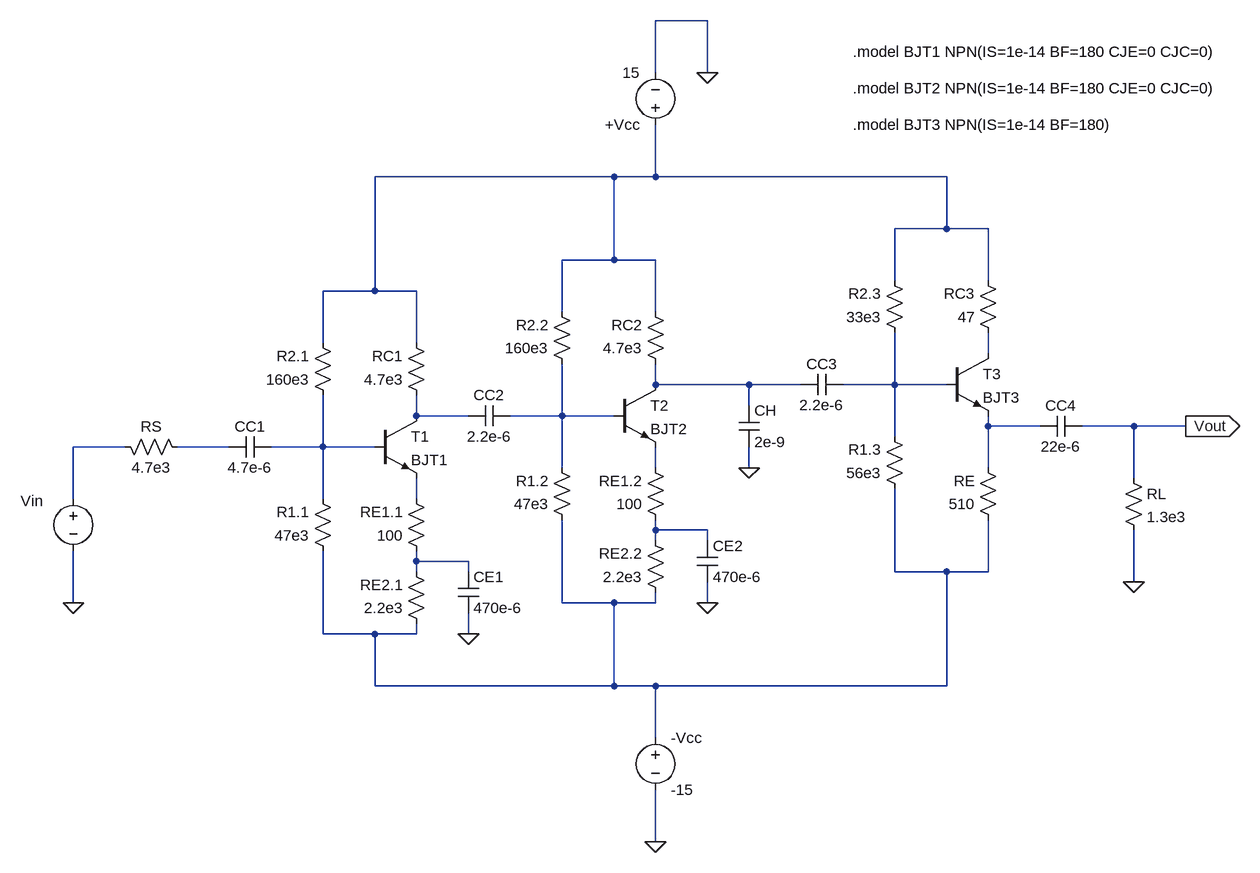
[diagram p0: schematic faz2B.asc]
faz2B.asc, the LTspice schematic file:
Version 4
SHEET 1 1896 1972
WIRE -336 -496 -416 -496
WIRE -416 -416 -416 -496
WIRE -336 -416 -336 -496
WIRE -480 -256 -848 -256
WIRE -416 -256 -416 -336
WIRE -416 -256 -480 -256
WIRE 32 -256 -416 -256
WIRE 32 -176 32 -256
WIRE 32 -176 -48 -176
WIRE 96 -176 32 -176
WIRE -480 -128 -480 -256
WIRE -480 -128 -560 -128
WIRE -416 -128 -480 -128
WIRE -48 -96 -48 -176
WIRE 96 -96 96 -176
WIRE -848 -80 -848 -256
WIRE -848 -80 -928 -80
WIRE -784 -80 -848 -80
WIRE -560 -48 -560 -128
WIRE -416 -48 -416 -128
WIRE -928 0 -928 -80
WIRE -784 0 -784 -80
WIRE 96 16 96 -16
WIRE -416 64 -416 32
WIRE -272 64 -416 64
WIRE -192 64 -272 64
WIRE -48 64 -48 -16
WIRE -48 64 -128 64
WIRE 32 64 -48 64
WIRE -272 96 -272 64
WIRE -784 112 -784 80
WIRE -704 112 -784 112
WIRE -560 112 -560 32
WIRE -560 112 -640 112
WIRE -480 112 -560 112
WIRE 96 128 96 112
WIRE 176 128 96 128
WIRE 320 128 240 128
WIRE 400 128 320 128
WIRE -48 144 -48 64
WIRE -1232 160 -1312 160
WIRE -1072 160 -1152 160
WIRE -928 160 -928 80
WIRE -928 160 -1008 160
WIRE -848 160 -928 160
WIRE -560 192 -560 112
WIRE -416 192 -416 160
WIRE -272 192 -272 160
WIRE 96 192 96 128
WIRE 320 208 320 128
WIRE -1312 240 -1312 160
WIRE -928 240 -928 160
WIRE -784 240 -784 208
WIRE -416 288 -416 272
WIRE -336 288 -416 288
WIRE -416 304 -416 288
WIRE -336 304 -336 288
WIRE -784 336 -784 320
WIRE -704 336 -784 336
WIRE -784 352 -784 336
WIRE -704 352 -704 336
WIRE -48 352 -48 224
WIRE 32 352 -48 352
WIRE 96 352 96 272
WIRE 96 352 32 352
WIRE 320 368 320 288
WIRE -1312 400 -1312 320
WIRE -560 400 -560 272
WIRE -480 400 -560 400
WIRE -416 400 -416 384
WIRE -416 400 -480 400
WIRE -336 400 -336 368
WIRE -928 448 -928 320
WIRE -848 448 -928 448
WIRE -784 448 -784 432
WIRE -784 448 -848 448
WIRE -704 448 -704 416
WIRE -848 528 -848 448
WIRE -480 528 -480 400
WIRE -480 528 -848 528
WIRE -416 528 -480 528
WIRE 32 528 32 352
WIRE 32 528 -416 528
WIRE -416 608 -416 528
WIRE -416 768 -416 688
FLAG 320 368 0
FLAG 400 128 Vout
IOPIN 400 128 Out
FLAG -704 448 0
FLAG -1312 400 0
FLAG -336 400 0
FLAG -416 768 0
FLAG -336 -416 0
FLAG -272 192 0
SYMBOL cap -128 48 R90
WINDOW 0 0 32 VBottom 2
WINDOW 3 32 32 VTop 2
SYMATTR InstName CC3
SYMATTR Value 2.2e-6
SYMBOL res -32 0 R180
WINDOW 0 36 76 Left 2
WINDOW 3 36 40 Left 2
SYMATTR InstName R2.3
SYMATTR Value 33e3
SYMBOL res -32 240 R180
WINDOW 0 36 76 Left 2
WINDOW 3 36 40 Left 2
SYMATTR InstName R1.3
SYMATTR Value 56e3
SYMBOL npn 32 16 R0
SYMATTR InstName T3
SYMATTR Value BJT3
SYMBOL res 112 0 R180
WINDOW 0 36 76 Left 2
WINDOW 3 36 40 Left 2
SYMATTR InstName RC3
SYMATTR Value 47
SYMBOL res 112 288 R180
WINDOW 0 36 76 Left 2
WINDOW 3 36 40 Left 2
SYMATTR InstName RE
SYMATTR Value 510
SYMBOL res -1248 144 M90
WINDOW 0 0 56 VBottom 2
WINDOW 3 32 56 VTop 2
SYMATTR InstName RS
SYMATTR Value 4.7e3
SYMBOL cap 240 112 R90
WINDOW 0 0 32 VBottom 2
WINDOW 3 32 32 VTop 2
SYMATTR InstName CC4
SYMATTR Value 22e-6
SYMBOL res 304 192 R0
SYMATTR InstName RL
SYMATTR Value 1.3e3
SYMBOL npn -848 112 R0
SYMATTR InstName T1
SYMATTR Value BJT1
SYMBOL res -912 96 R180
WINDOW 0 36 76 Left 2
WINDOW 3 36 40 Left 2
SYMATTR InstName R2.1
SYMATTR Value 160e3
SYMBOL res -768 96 R180
WINDOW 0 36 76 Left 2
WINDOW 3 36 40 Left 2
SYMATTR InstName RC1
SYMATTR Value 4.7e3
SYMBOL res -912 336 R180
WINDOW 0 36 76 Left 2
WINDOW 3 36 40 Left 2
SYMATTR InstName R1.1
SYMATTR Value 47e3
SYMBOL res -768 336 R180
WINDOW 0 36 76 Left 2
WINDOW 3 36 40 Left 2
SYMATTR InstName RE1.1
SYMATTR Value 100
SYMBOL res -768 448 R180
WINDOW 0 36 76 Left 2
WINDOW 3 36 40 Left 2
SYMATTR InstName RE2.1
SYMATTR Value 2.2e3
SYMBOL cap -720 352 R0
SYMATTR InstName CE1
SYMATTR Value 470e-6
SYMBOL cap -1008 144 R90
WINDOW 0 0 32 VBottom 2
WINDOW 3 32 32 VTop 2
SYMATTR InstName CC1
SYMATTR Value 4.7e-6
SYMBOL voltage -1312 224 R0
WINDOW 123 -81 47 Left 2
WINDOW 39 0 0 Left 0
WINDOW 0 -81 19 Left 2
WINDOW 3 -81 47 Left 2
SYMATTR InstName Vin
SYMATTR Value ""
SYMBOL cap -288 96 R0
SYMATTR InstName CH
SYMATTR Value 2e-9
SYMBOL npn -480 64 R0
SYMATTR InstName T2
SYMATTR Value BJT2
SYMBOL res -544 48 R180
WINDOW 0 36 76 Left 2
WINDOW 3 36 40 Left 2
SYMATTR InstName R2.2
SYMATTR Value 160e3
SYMBOL res -400 48 R180
WINDOW 0 36 76 Left 2
WINDOW 3 36 40 Left 2
SYMATTR InstName RC2
SYMATTR Value 4.7e3
SYMBOL res -544 288 R180
WINDOW 0 36 76 Left 2
WINDOW 3 36 40 Left 2
SYMATTR InstName R1.2
SYMATTR Value 47e3
SYMBOL res -400 288 R180
WINDOW 0 36 76 Left 2
WINDOW 3 36 40 Left 2
SYMATTR InstName RE1.2
SYMATTR Value 100
SYMBOL res -400 400 R180
WINDOW 0 36 76 Left 2
WINDOW 3 36 40 Left 2
SYMATTR InstName RE2.2
SYMATTR Value 2.2e3
SYMBOL cap -352 304 R0
SYMATTR InstName CE2
SYMATTR Value 470e-6
SYMBOL cap -640 96 R90
WINDOW 0 0 32 VBottom 2
WINDOW 3 32 32 VTop 2
SYMATTR InstName CC2
SYMATTR Value 2.2e-6
SYMBOL voltage -416 592 R0
WINDOW 123 0 0 Left 0
WINDOW 39 0 0 Left 0
SYMATTR InstName -Vcc
SYMATTR Value -15
SYMBOL voltage -416 -320 R180
WINDOW 123 0 0 Left 0
WINDOW 39 0 0 Left 0
SYMATTR InstName +Vcc
SYMATTR Value 15
TEXT -112 -336 Left 2 !.model BJT3 NPN(IS=1e-14 BF=180)
TEXT -112 -448 Left 2 !.model BJT1 NPN(IS=1e-14 BF=180 CJE=0 CJC=0)
TEXT -112 -392 Left 2 !.model BJT2 NPN(IS=1e-14 BF=180 CJE=0 CJC=0)

The netlist it stands for:
* faz2B.asc
CC3 N004 N003 2.2e-6
R2.3 N004 N001 33e3
R1.3 N015 N004 56e3
Q§T3 N002 N004 N007 0 BJT3
RC3 N002 N001 47
RE N015 N007 510
RS N008 N009 4.7e3
CC4 Vout N007 22e-6
RL Vout 0 1.3e3
Q§T1 N005 N010 N012 0 BJT1
R2.1 N010 N001 160e3
RC1 N005 N001 4.7e3
R1.1 N015 N010 47e3
RE1.1 N014 N012 100
RE2.1 N015 N014 2.2e3
CE1 N014 0 470e-6
CC1 N010 N009 4.7e-6
Vin N008 0
CH N003 0 2e-9
Q§T2 N003 N006 N011 0 BJT2
R2.2 N006 N001 160e3
RC2 N003 N001 4.7e3
R1.2 N015 N006 47e3
RE1.2 N013 N011 100
RE2.2 N015 N013 2.2e3
CE2 N013 0 470e-6
CC2 N006 N005 2.2e-6
V§-Vcc N015 0 -15
V§+Vcc N001 0 15
.model NPN NPN
.model PNP PNP
.lib standard.bjt
.model BJT3 NPN(IS=1e-14 BF=180)
.model BJT1 NPN(IS=1e-14 BF=180 CJE=0 CJC=0)
.model BJT2 NPN(IS=1e-14 BF=180 CJE=0 CJC=0)
.backanno
.end